# EAGLE design SunriseClockSwitchesv2 (EAGLE 7.6.0)
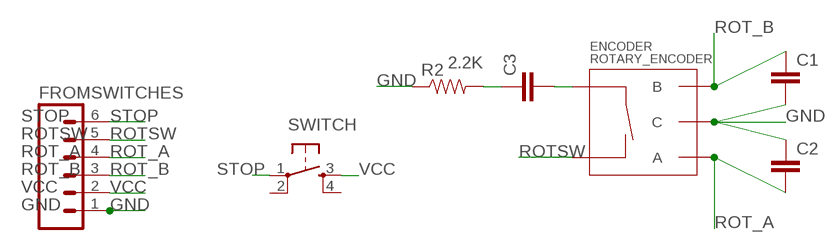
[diagram p0: schematic, sheet 1]

## Parts
C1  CAPEZ  [CAP-PTH-SMALLEZ]
C2  CAPEZ  [CAP-PTH-SMALLEZ]
C3  CAPEZ  [CAP-PTH-SMALLEZ]
ENCODER  ROTARY_ENCODER  ROTARTY_ENCODER  [ROTARY_ENC_PLAIN]
FROMSWITCHES  M06LOCK  [1X06_LOCK]
R2  RESISTORPTH-1/4W  [AXIAL-0.4]
SWITCH  TAC_SWITCHPTH  [TACTILE-PTH]

## Nets
GND: C1.2 C2.1 ENCODER.C FROMSWITCHES.1 R2.P$1
N$12: C3.1 R2.P$2
N$13: C3.2 ENCODER.SW+
ROT_A: C2.2 ENCODER.A FROMSWITCHES.4
ROT_B: C1.1 ENCODER.B FROMSWITCHES.3
ROTSW: ENCODER.SW- FROMSWITCHES.5
STOP: FROMSWITCHES.6 SWITCH.1
VCC: FROMSWITCHES.2 SWITCH.3
Unconnected: SWITCH.2 SWITCH.4

## Library data of the parts
C1-C3 = SparkFun-Capacitors:CAP: Capacitor Standard 0603 ceramic capacitor, and 0.1" leaded capacitor.
ENCODER = SparkFun-Electromechanical:ROTARTY_ENCODER: Simple no LED rotary encoder Example: COM-09117
FROMSWITCHES = SparkFun-Connectors:M06: Header 6 Standard 6-pin 0.1" header. Use with straight break away headers (SKU : PRT-00116), right angle break away headers (PRT-00553), swiss pins (PRT-00743), machine pins (PRT-00117), and female headers (PRT-00115). Molex polarized connector foot print use with SKU : PRT-08094 with associated crimp pins and housings. NOTES ON THE VARIANTS LOCK and LOCK_LONGPADS... This footprint was designed to help hold the alignment of a through-hole component (i.e. 6-pin header) while soldering it into place. You may notice that each hole has been shifted either up or down by 0.005 of an inch from it's more standard position (which is a perfectly straight line). This slight alteration caused the pins (the squares in the middle) to touch the edges of the holes. Because they are alternating, it causes a "brace" to hold the component in place. 0.005 has proven to be the perfect amount of "off-center" position when using our standard breakaway headers. Although looks a little odd when you look at the bare footprint, once you have a header in there, the alteration is very hard to notice. Also,if you push a header all the way into place, it is covered up entirely on the bottom side. This idea of altering the position of holes to aid alignment will be further integrated into the Sparkfun Library for other footprints. It can help hold any component with 3 or more connection pins.
R2 = SparkFun-Resistors:RESISTOR: Resistor Basic schematic elements and footprints for 0603, 1206, and PTH resistors.; R2: 2.2K
SWITCH = SparkFun-Retired:TAC_SWITCH: Momentary Switch Button commonly used for reset or general input. Spark Fun Electronics SKU : COM-00097 SMT- SWCH-08247

## Board
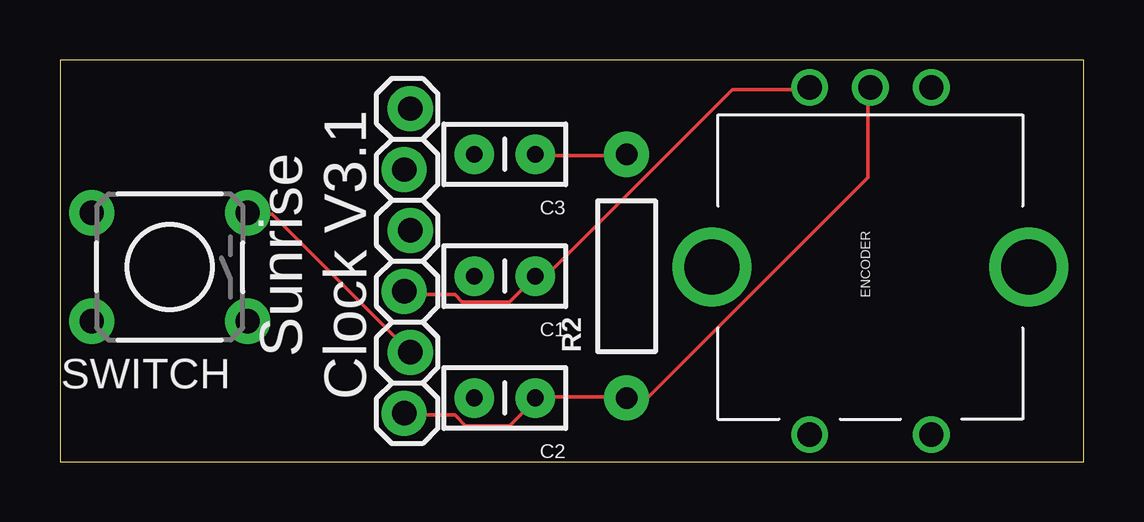
[diagram p1: board, top side]
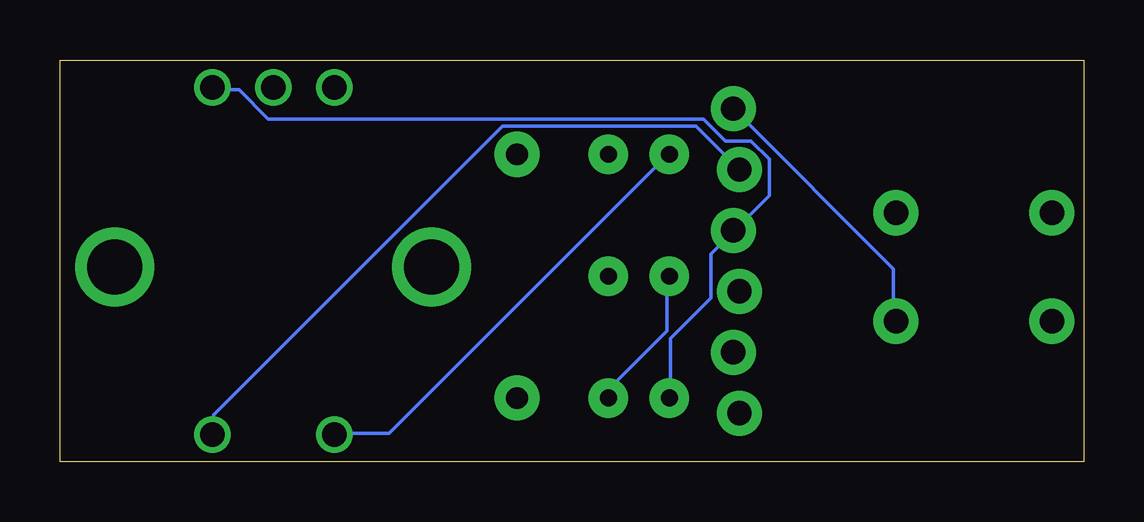
[diagram p2: board, bottom side, seen from below]

Size 42.67 x 16.76 mm. Coordinates in mm from the lower left corner, seen from the top.
Outline: 42.67,0 42.67,16.76 0,16.76 0,0 42.67,0
Copper layers (1*16): Top 0.0356mm / dielectric 1.5011mm / Bottom 0.0356mm
Design rules "oshpark-2layer": minimum track width 6mil, minimum drill 13mil, track to track 6mil, track to pad 6mil, pad to pad 6mil, via to via 6mil, smd to smd 6mil, copper to edge 15mil, drill to drill 6mil, minimum pad ring 7mil, minimum via ring 7mil, stop-mask expansion 2.5mil, vias tented up to drill 0mil, thermal gap 10mil

### Footprints (pad centres in the part's own frame; a part is rotated, then mirrored left to right if it is on the bottom)
CAP-PTH-SMALLEZ = drill 0.7 pad 1.651: 1 0,0; 2 2.54,0
ROTARY_ENC_PLAIN = drill 1.016: A 7.493,-2.54; B 7.493,2.54; C 7.493,0; SW+ -6.985,2.54; SW- -6.985,-2.54 | drill 2.286: P$3 0,6.604; P$4 0,-6.604
1X06_LOCK = drill 1.016 pad 1.88: 1 0,0; 2 2.54,-0.254; 3 5.08,0; 4 7.62,-0.254; 5 10.16,0; 6 12.7,-0.254
AXIAL-0.4 = drill 0.9 pad 1.88: P$1 -5.08,0; P$2 5.08,0
TACTILE-PTH = drill 1.016 pad 1.88: 1 -3.251,2.261; 2 3.251,2.261; 3 -3.251,-2.261; 4 3.251,-2.261

### Placement (x,y rotation side)
C1  19.81,7.75 180 top
C2  19.81,2.67 180 top
C3  19.81,12.83 180 top
ENCODER  33.78,8.13 90 top
FROMSWITCHES  14.35,2.03 90 top
R2  23.62,7.75 90 top
SWITCH  4.57,8.13 180 top

### Tracks (layer width: path | path; a pad name or v marks a point on that pad's centre or on a via)
GND
  Top 0.152: 23.62,2.72 24.54,2.72 33.68,11.86 33.68,15.52 ENCODER.C | 23.62,2.72 19.81,2.72 C2.1 19.81,2.57 18.75,1.5 16.92,1.5 16.46,1.96 14.48,1.96 FROMSWITCHES.1 | 23.62,2.72 R2.P$1
  Bottom 0.152: C2.1 19.81,3.02 17.37,5.46 17.37,7.75 C1.2
N$12
  Top 0.152: C3.1 19.81,12.78 23.62,12.78 R2.P$2
N$13
  Bottom 0.152: ENCODER.SW+ 31.24,1.19 28.96,1.19 17.37,12.78 C3.2
ROT_A
  Bottom 0.152: ENCODER.A 36.27,15.52 35.2,15.52 33.98,14.3 15.85,14.3 14.94,13.39 13.87,13.39 13.11,12.62 13.11,11.1 14.48,9.73 FROMSWITCHES.4 14.63,9.58 15.55,8.66 15.55,6.83 17.22,5.16 17.22,2.72 C2.2
ROT_B
  Top 0.152: ENCODER.B 31.24,15.52 28.04,15.52 20.27,7.75 C1.1 18.75,6.68 16.76,6.68 16.46,6.98 14.48,6.98 FROMSWITCHES.3
ROTSW
  Bottom 0.152: FROMSWITCHES.5 16.15,14 24.23,14 36.27,1.96 36.27,1.19 ENCODER.SW-
STOP
  Bottom 0.152: FROMSWITCHES.6 7.93,8.05 7.93,5.92 SWITCH.1
VCC
  Top 0.152: FROMSWITCHES.2 8.84,10.34 7.93,10.34 SWITCH.3

### Text on the board
tPlace: Sunrise / Clock V3.1